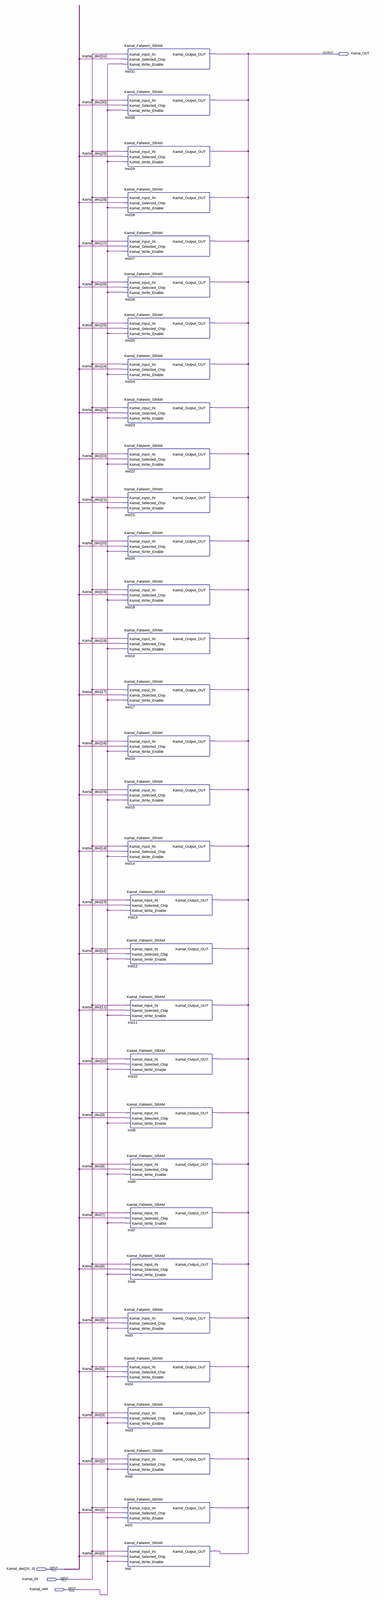
[diagram p0: schematic sheet, whole]
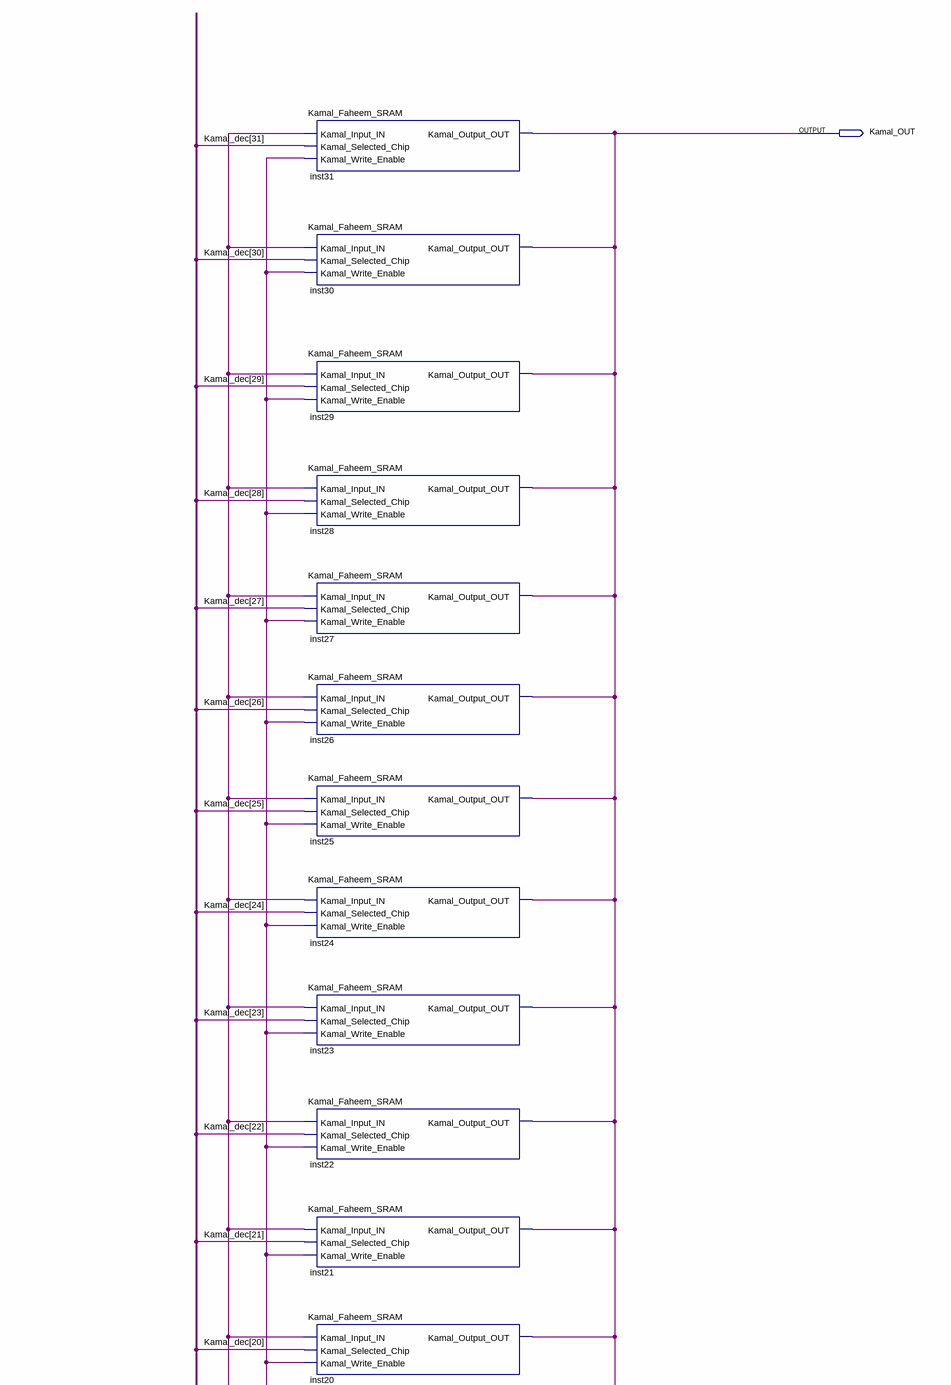
[diagram p1: schematic sheet, upper part]
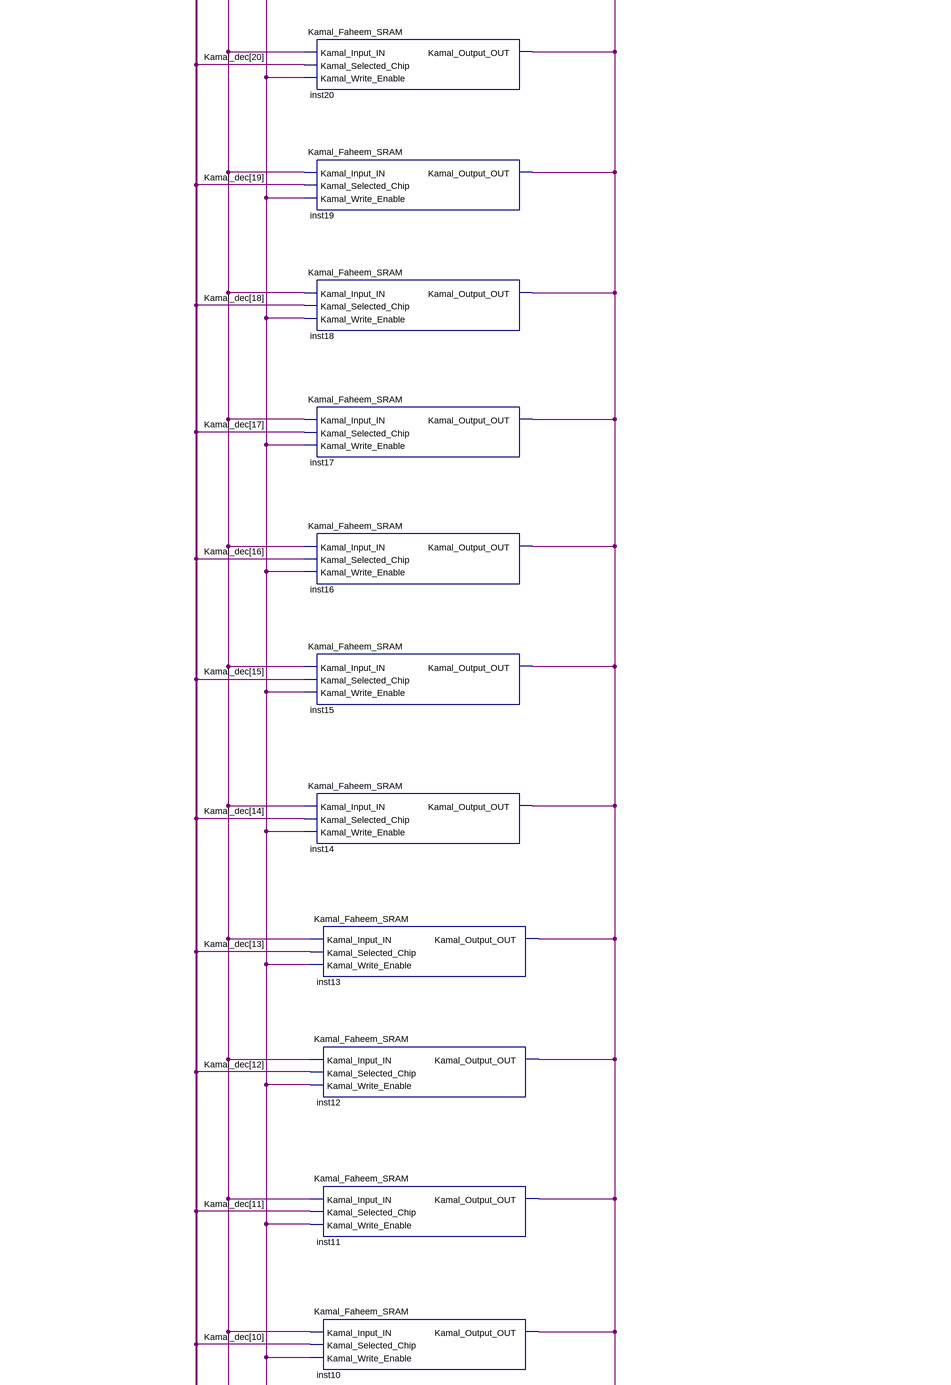
[diagram p2: schematic sheet, middle part]
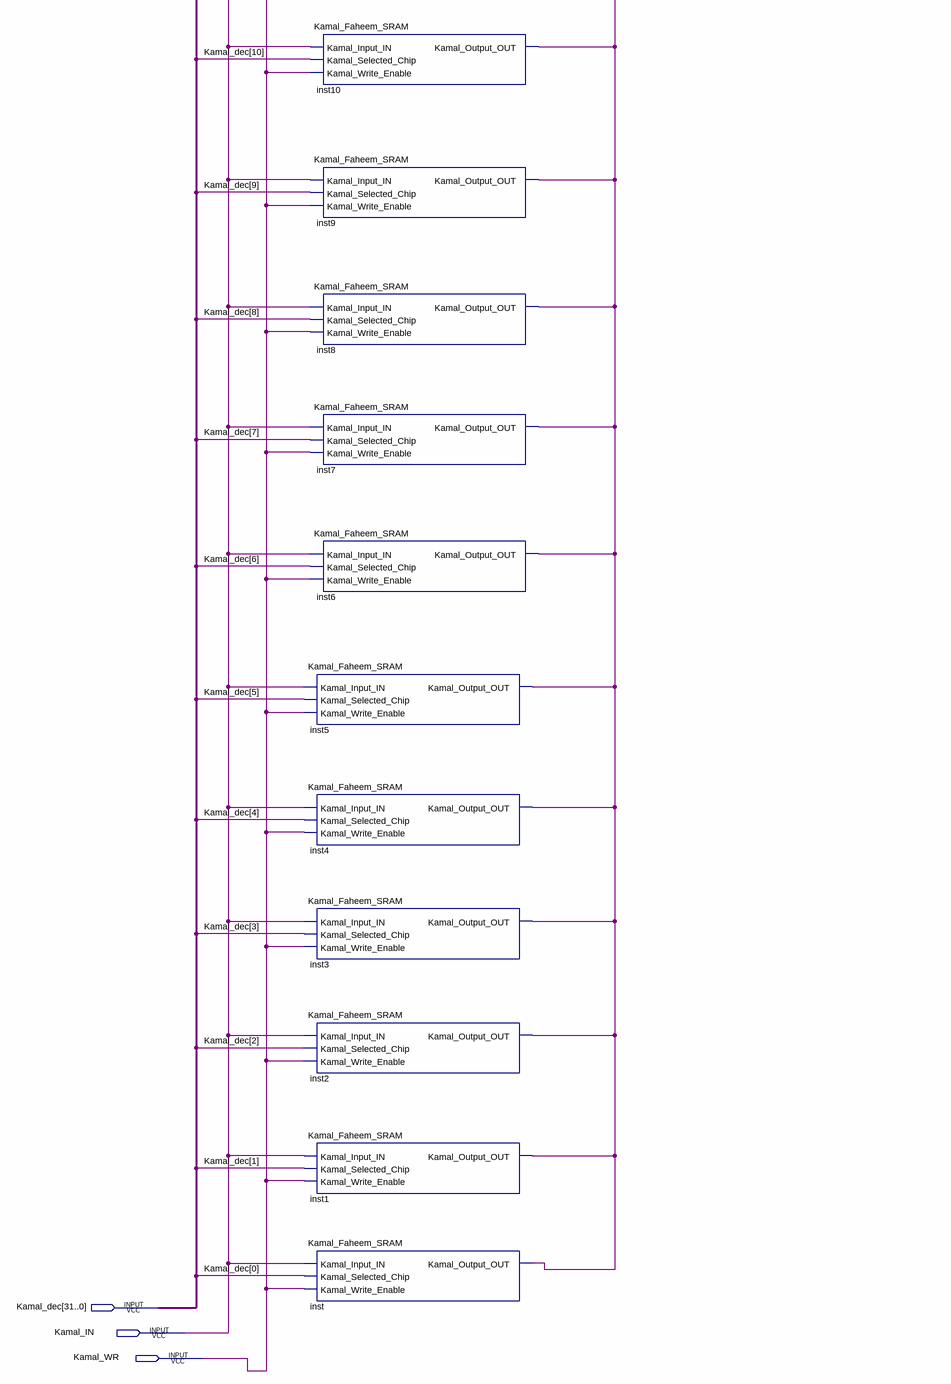
[diagram p3: schematic sheet, lower part]
// Quartus schematic Kamal_Faheem_32x1SRAM.bdf as structural Verilog: 32 symbols, 4 pins
module Kamal_Faheem_32x1SRAM (
  input  [31:0] Kamal_dec,
  input  Kamal_IN,
  input  Kamal_WR,
  output Kamal_OUT
);

  Kamal_Faheem_SRAM inst31 (
    .Kamal_Input_IN(Kamal_IN), .Kamal_Selected_Chip(Kamal_dec[31]), .Kamal_Write_Enable(Kamal_WR),
    .Kamal_Output_OUT(Kamal_OUT));
  Kamal_Faheem_SRAM inst30 (
    .Kamal_Input_IN(Kamal_IN), .Kamal_Selected_Chip(Kamal_dec[30]), .Kamal_Write_Enable(Kamal_WR),
    .Kamal_Output_OUT(Kamal_OUT));
  Kamal_Faheem_SRAM inst29 (
    .Kamal_Input_IN(Kamal_IN), .Kamal_Selected_Chip(Kamal_dec[29]), .Kamal_Write_Enable(Kamal_WR),
    .Kamal_Output_OUT(Kamal_OUT));
  Kamal_Faheem_SRAM inst28 (
    .Kamal_Input_IN(Kamal_IN), .Kamal_Selected_Chip(Kamal_dec[28]), .Kamal_Write_Enable(Kamal_WR),
    .Kamal_Output_OUT(Kamal_OUT));
  Kamal_Faheem_SRAM inst27 (
    .Kamal_Input_IN(Kamal_IN), .Kamal_Selected_Chip(Kamal_dec[27]), .Kamal_Write_Enable(Kamal_WR),
    .Kamal_Output_OUT(Kamal_OUT));
  Kamal_Faheem_SRAM inst26 (
    .Kamal_Input_IN(Kamal_IN), .Kamal_Selected_Chip(Kamal_dec[26]), .Kamal_Write_Enable(Kamal_WR),
    .Kamal_Output_OUT(Kamal_OUT));
  Kamal_Faheem_SRAM inst25 (
    .Kamal_Input_IN(Kamal_IN), .Kamal_Selected_Chip(Kamal_dec[25]), .Kamal_Write_Enable(Kamal_WR),
    .Kamal_Output_OUT(Kamal_OUT));
  Kamal_Faheem_SRAM inst24 (
    .Kamal_Input_IN(Kamal_IN), .Kamal_Selected_Chip(Kamal_dec[24]), .Kamal_Write_Enable(Kamal_WR),
    .Kamal_Output_OUT(Kamal_OUT));
  Kamal_Faheem_SRAM inst23 (
    .Kamal_Input_IN(Kamal_IN), .Kamal_Selected_Chip(Kamal_dec[23]), .Kamal_Write_Enable(Kamal_WR),
    .Kamal_Output_OUT(Kamal_OUT));
  Kamal_Faheem_SRAM inst22 (
    .Kamal_Input_IN(Kamal_IN), .Kamal_Selected_Chip(Kamal_dec[22]), .Kamal_Write_Enable(Kamal_WR),
    .Kamal_Output_OUT(Kamal_OUT));
  Kamal_Faheem_SRAM inst21 (
    .Kamal_Input_IN(Kamal_IN), .Kamal_Selected_Chip(Kamal_dec[21]), .Kamal_Write_Enable(Kamal_WR),
    .Kamal_Output_OUT(Kamal_OUT));
  Kamal_Faheem_SRAM inst20 (
    .Kamal_Input_IN(Kamal_IN), .Kamal_Selected_Chip(Kamal_dec[20]), .Kamal_Write_Enable(Kamal_WR),
    .Kamal_Output_OUT(Kamal_OUT));
  Kamal_Faheem_SRAM inst19 (
    .Kamal_Input_IN(Kamal_IN), .Kamal_Selected_Chip(Kamal_dec[19]), .Kamal_Write_Enable(Kamal_WR),
    .Kamal_Output_OUT(Kamal_OUT));
  Kamal_Faheem_SRAM inst18 (
    .Kamal_Input_IN(Kamal_IN), .Kamal_Selected_Chip(Kamal_dec[18]), .Kamal_Write_Enable(Kamal_WR),
    .Kamal_Output_OUT(Kamal_OUT));
  Kamal_Faheem_SRAM inst17 (
    .Kamal_Input_IN(Kamal_IN), .Kamal_Selected_Chip(Kamal_dec[17]), .Kamal_Write_Enable(Kamal_WR),
    .Kamal_Output_OUT(Kamal_OUT));
  Kamal_Faheem_SRAM inst16 (
    .Kamal_Input_IN(Kamal_IN), .Kamal_Selected_Chip(Kamal_dec[16]), .Kamal_Write_Enable(Kamal_WR),
    .Kamal_Output_OUT(Kamal_OUT));
  Kamal_Faheem_SRAM inst15 (
    .Kamal_Input_IN(Kamal_IN), .Kamal_Selected_Chip(Kamal_dec[15]), .Kamal_Write_Enable(Kamal_WR),
    .Kamal_Output_OUT(Kamal_OUT));
  Kamal_Faheem_SRAM inst14 (
    .Kamal_Input_IN(Kamal_IN), .Kamal_Selected_Chip(Kamal_dec[14]), .Kamal_Write_Enable(Kamal_WR),
    .Kamal_Output_OUT(Kamal_OUT));
  Kamal_Faheem_SRAM inst5 (
    .Kamal_Input_IN(Kamal_IN), .Kamal_Selected_Chip(Kamal_dec[5]), .Kamal_Write_Enable(Kamal_WR),
    .Kamal_Output_OUT(Kamal_OUT));
  Kamal_Faheem_SRAM inst4 (
    .Kamal_Input_IN(Kamal_IN), .Kamal_Selected_Chip(Kamal_dec[4]), .Kamal_Write_Enable(Kamal_WR),
    .Kamal_Output_OUT(Kamal_OUT));
  Kamal_Faheem_SRAM inst3 (
    .Kamal_Input_IN(Kamal_IN), .Kamal_Selected_Chip(Kamal_dec[3]), .Kamal_Write_Enable(Kamal_WR),
    .Kamal_Output_OUT(Kamal_OUT));
  Kamal_Faheem_SRAM inst2 (
    .Kamal_Input_IN(Kamal_IN), .Kamal_Selected_Chip(Kamal_dec[2]), .Kamal_Write_Enable(Kamal_WR),
    .Kamal_Output_OUT(Kamal_OUT));
  Kamal_Faheem_SRAM inst1 (
    .Kamal_Input_IN(Kamal_IN), .Kamal_Selected_Chip(Kamal_dec[1]), .Kamal_Write_Enable(Kamal_WR),
    .Kamal_Output_OUT(Kamal_OUT));
  Kamal_Faheem_SRAM inst (
    .Kamal_Input_IN(Kamal_IN), .Kamal_Selected_Chip(Kamal_dec[0]), .Kamal_Write_Enable(Kamal_WR),
    .Kamal_Output_OUT(Kamal_OUT));
  Kamal_Faheem_SRAM inst13 (
    .Kamal_Input_IN(Kamal_IN), .Kamal_Selected_Chip(Kamal_dec[13]), .Kamal_Write_Enable(Kamal_WR),
    .Kamal_Output_OUT(Kamal_OUT));
  Kamal_Faheem_SRAM inst12 (
    .Kamal_Input_IN(Kamal_IN), .Kamal_Selected_Chip(Kamal_dec[12]), .Kamal_Write_Enable(Kamal_WR),
    .Kamal_Output_OUT(Kamal_OUT));
  Kamal_Faheem_SRAM inst11 (
    .Kamal_Input_IN(Kamal_IN), .Kamal_Selected_Chip(Kamal_dec[11]), .Kamal_Write_Enable(Kamal_WR),
    .Kamal_Output_OUT(Kamal_OUT));
  Kamal_Faheem_SRAM inst10 (
    .Kamal_Input_IN(Kamal_IN), .Kamal_Selected_Chip(Kamal_dec[10]), .Kamal_Write_Enable(Kamal_WR),
    .Kamal_Output_OUT(Kamal_OUT));
  Kamal_Faheem_SRAM inst9 (
    .Kamal_Input_IN(Kamal_IN), .Kamal_Selected_Chip(Kamal_dec[9]), .Kamal_Write_Enable(Kamal_WR),
    .Kamal_Output_OUT(Kamal_OUT));
  Kamal_Faheem_SRAM inst8 (
    .Kamal_Input_IN(Kamal_IN), .Kamal_Selected_Chip(Kamal_dec[8]), .Kamal_Write_Enable(Kamal_WR),
    .Kamal_Output_OUT(Kamal_OUT));
  Kamal_Faheem_SRAM inst7 (
    .Kamal_Input_IN(Kamal_IN), .Kamal_Selected_Chip(Kamal_dec[7]), .Kamal_Write_Enable(Kamal_WR),
    .Kamal_Output_OUT(Kamal_OUT));
  Kamal_Faheem_SRAM inst6 (
    .Kamal_Input_IN(Kamal_IN), .Kamal_Selected_Chip(Kamal_dec[6]), .Kamal_Write_Enable(Kamal_WR),
    .Kamal_Output_OUT(Kamal_OUT));
endmodule
